# EAGLE design IC555 (EAGLE 9.6.2)
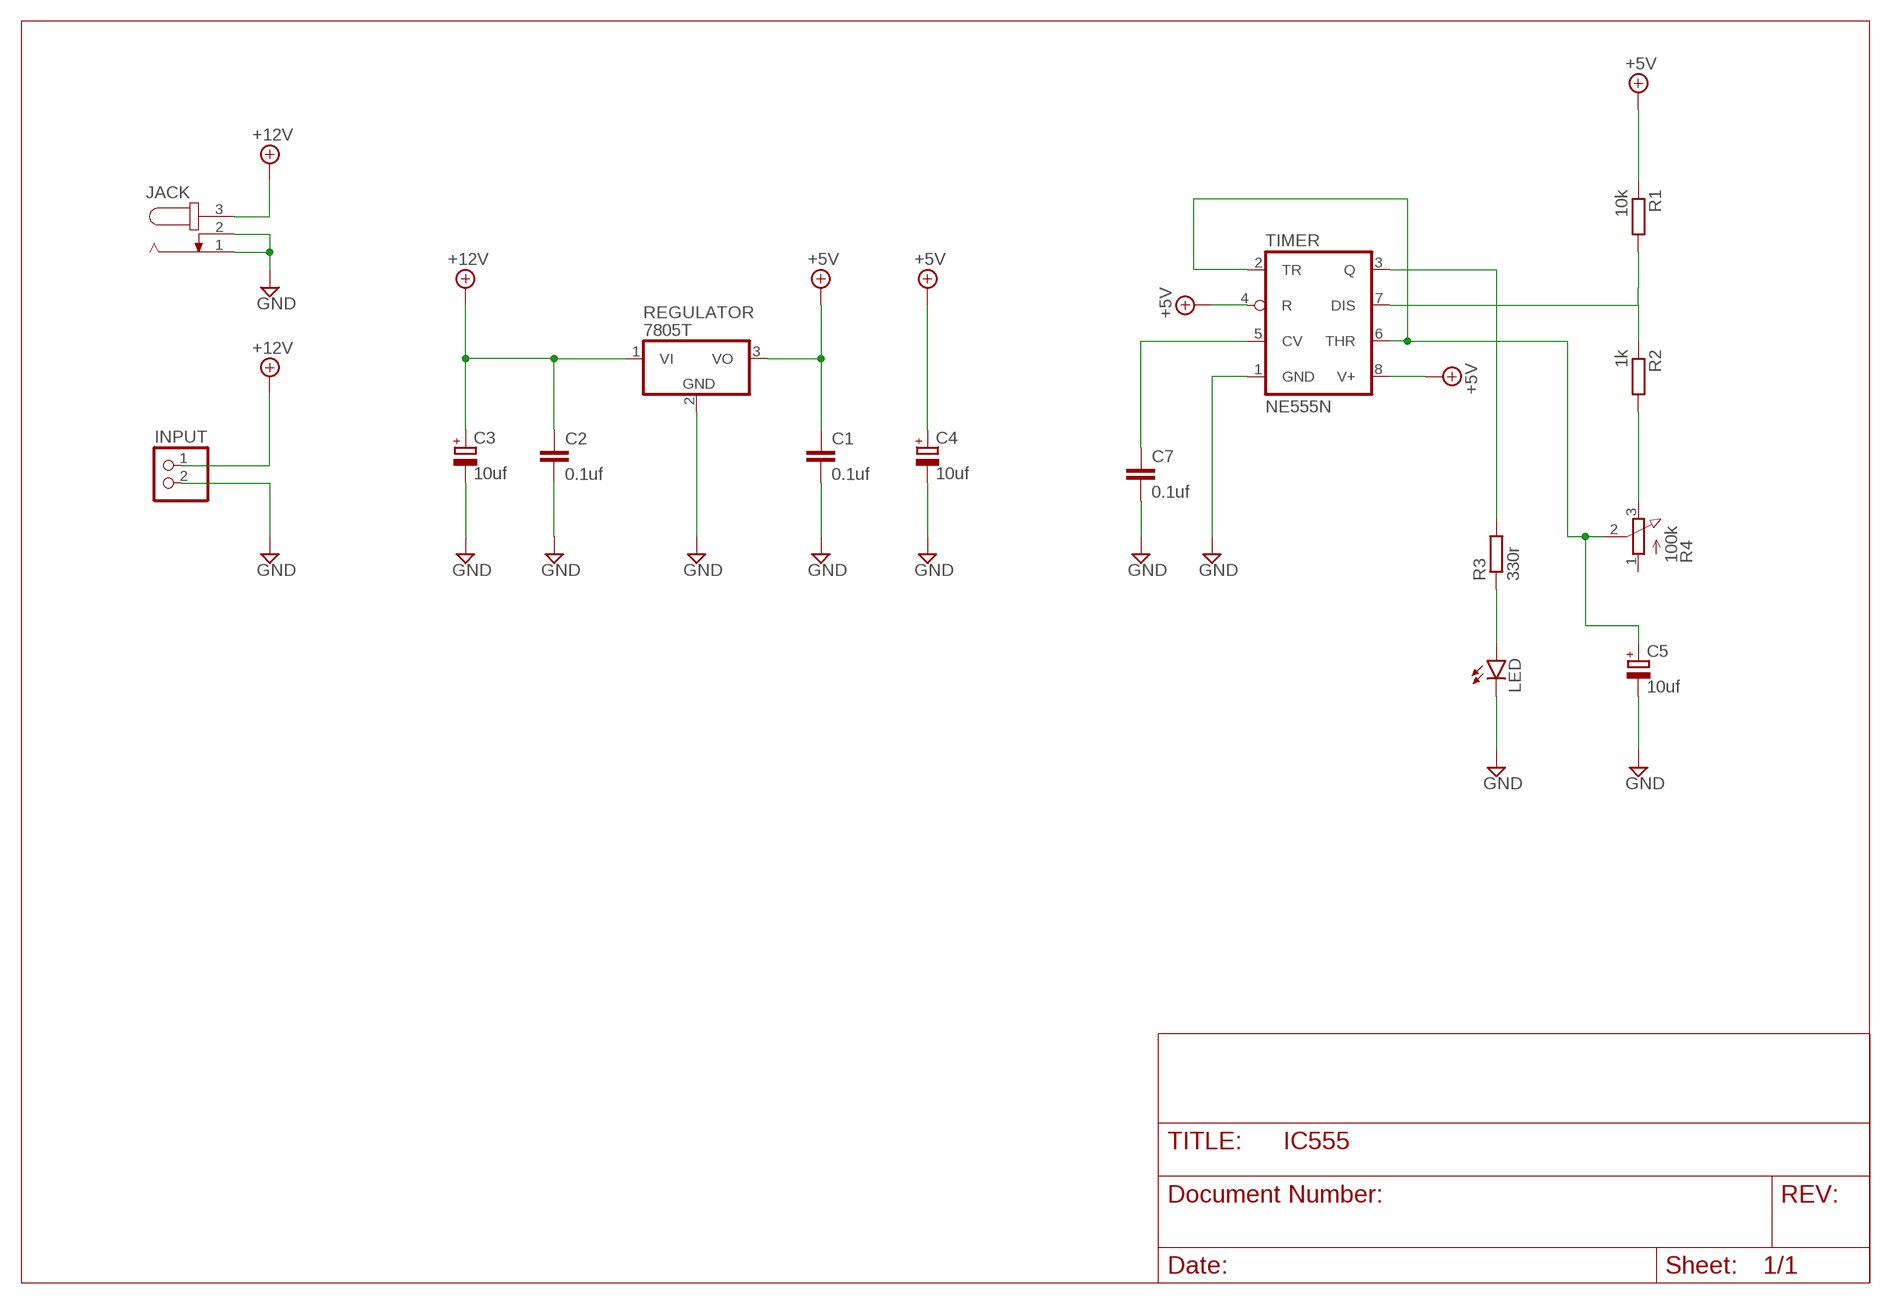
[diagram p0: schematic, sheet 1]

## Parts
C1  0.1uf  C-EU050-030X075  [C050-030X075]
C2  0.1uf  C-EU050-030X075  [C050-030X075]
C3  10uf  CPOL-EUE3.5-8  [E3,5-8]
C4  10uf  CPOL-EUE3.5-8  [E3,5-8]
C5  10uf  CPOL-EUE3.5-8  [E3,5-8]
C7  0.1uf  C-EU050-030X075  [C050-030X075]
INPUT  PINHD-1X2  [1X02]
JACK  JACK-PLUG0  [SPC4077]
LED  LED5MM  [LED5MM]
R1  10k  R-EU_0207/10  [0207/10]
R2  1k  R-EU_0207/10  [0207/10]
R3  330r  R-EU_0207/10  [0207/10]
R4  100k  3RP/1610N  [3RP/1610N]
REGULATOR  7805T  [TO220H]
TIMER  NE555N  [DIL08]

## Nets
+5V [POWER]: C1.1 C4.+ R1.1 REGULATOR.3(VO) TIMER.4(R) TIMER.8(V+)
+12V [POWER]: C2.1 C3.+ INPUT.1 JACK.3 REGULATOR.1(VI)
GND [POWER]: C1.2 C2.2 C3.- C4.- C5.- C7.2 INPUT.2 JACK.1 JACK.2 LED.K(C) REGULATOR.2(GND) TIMER.1(GND)
N$2: C7.1 TIMER.5(CV)
N$4: R3.2 TIMER.3(Q)
N$5: LED.A R3.1
N$6: R1.2 R2.1 TIMER.7(DIS)
N$7: R2.2 R4.3(E)
N$8: C5.+ R4.2(S) TIMER.2(TR) TIMER.6(THR)
Unconnected: R4.1(A)

## Library data of the parts
C1 C2 C7 = rcl:C-EU: CAPACITOR, European symbol; SPICEPREFIX: C
C3-C5 = rcl:CPOL-EU: POLARIZED CAPACITOR, European symbol; SPICEPREFIX: C
INPUT = pinhead:PINHD-1X2: PIN HEADER
JACK = con-jack:JACK-PLUG: DC POWER JACK Power Jack, DC, Right Angle, Through Hole, Rated 5A at 16VDC, PC Terminals Distributor: Farnell (www.Farnell.de) Drawing: 84N1161.pdf / 84N1162.pdf Manufacturer: SPC Technology (www.spctechnology.com) Type: SPC4077 / SPC 4078; OC_FARNELL: unknown; OC_NEWARK: unknown
LED = led:LED: LED OSRAM: - CHIPLED LG R971, LG N971, LY N971, LG Q971, LY Q971, LO R971, LY R971 LH N974, LH R974 LS Q976, LO Q976, LY Q976 LO Q996 - Hyper CHIPLED LW Q18S LB Q993, LB Q99A, LB R99A - SideLED LS A670, LO A670, LY A670, LG A670, LP A670 LB A673, LV A673, LT A673, LW A673 LH A674 LY A675 LS A676, LA A676, LO A676, LY A676, LW A676 LS A679, LY A679, LG A679 - Hyper Micro SIDELED® LS Y876, LA Y876, LO Y876, LY Y876 LT Y87S - SmartLED LW L88C, LW L88S LB L89C, LB L89S, LG L890 LS L89K, LO L89K, LY L89K LS L896, LA L896, LO L896, LY L896 - TOPLED LS T670, LO T670, LY T670, LG T670, LP T670 LSG T670, LSP T670, LSY T670, LOP T670, LYG T670 LG T671, LOG T671, LSG T671 LB T673, LV T673, LT T673, LW T673 LH T674 LS T676, LA T676, LO T676, LY T676, LB T676, LH T676, LSB T676, LW T676 LB T67C, LV T67C, LT T67C, LS T67K, LO T67K, LY T67K, LW E67C LS E67B, LA E67B, LO E67B, LY E67B, LB E67C, LV E67C, LT E67C LW T67C LS T679, LY T679, LG T679 LS T770, LO T770, LY T770, LG T770, LP T770 LB T773, LV T773, LT T773, LW T773 LH T774 LS E675, LA E675, LY E675, LS T675 LS T776, LA T776, LO T776, LY T776, LB T776 LHGB T686 LT T68C, LB T68C - Hyper Mini TOPLED® LB M676 - Mini TOPLED Santana® LG M470 LS M47K, LO M47K, LY M47K Source: http://www.osram.convergy.de LUXEON: - LUMILED® LXK2-PW12-R00, LXK2-PW12-S00, LXK2-PW14-U00, LXK2-PW14-V00 LXK2-PM12-R00, LXK2-PM12-S00, LXK2-PM14-U00 LXK2-PE12-Q00, LXK2-PE12-R00, LXK2-PE12-S00, LXK2-PE14-T00, LXK2-PE14-U00 LXK2-PB12-K00, LXK2-PB12-L00, LXK2-PB12-M00, LXK2-PB14-N00, LXK2-PB14-P00, LXK2-PB14-Q00 LXK2-PR12-L00, LXK2-PR12-M00, LXK2-PR14-Q00, LXK2-PR14-R00 LXK2-PD12-Q00, LXK2-PD12-R00, LXK2-PD12-S00 LXK2-PH12-R00, LXK2-PH12-S00 LXK2-PL12-P00, LXK2-PL12-Q00, LXK2-PL12-R00 Source: www.luxeon.com KINGBRIGHT: KA-3528ASYC Source: www.kingbright.com
R1-R3 = rcl:R-EU_: RESISTOR, European symbol; SPICEPREFIX: R
R4 = pot:3RP/1610N: 16mm Potentiometer one level Source: http://www.alphapotentiometers.net/html/16mm_pot_2.html
REGULATOR = linear:78*: Positive VOLTAGE REGULATOR Source: http://cache.national.com/ds/LM/LM78L05.pdf http://www.fairchildsemi.com/ds/LM/LM7805.pdf
TIMER = linear:*555: TIMER

## Net classes
0 default: width 0.305 mm, drill 0.305 mm, clearance 0.254 mm
1 POWER: width 0.406 mm, drill 0.406 mm, clearance 0.406 mm

## Board
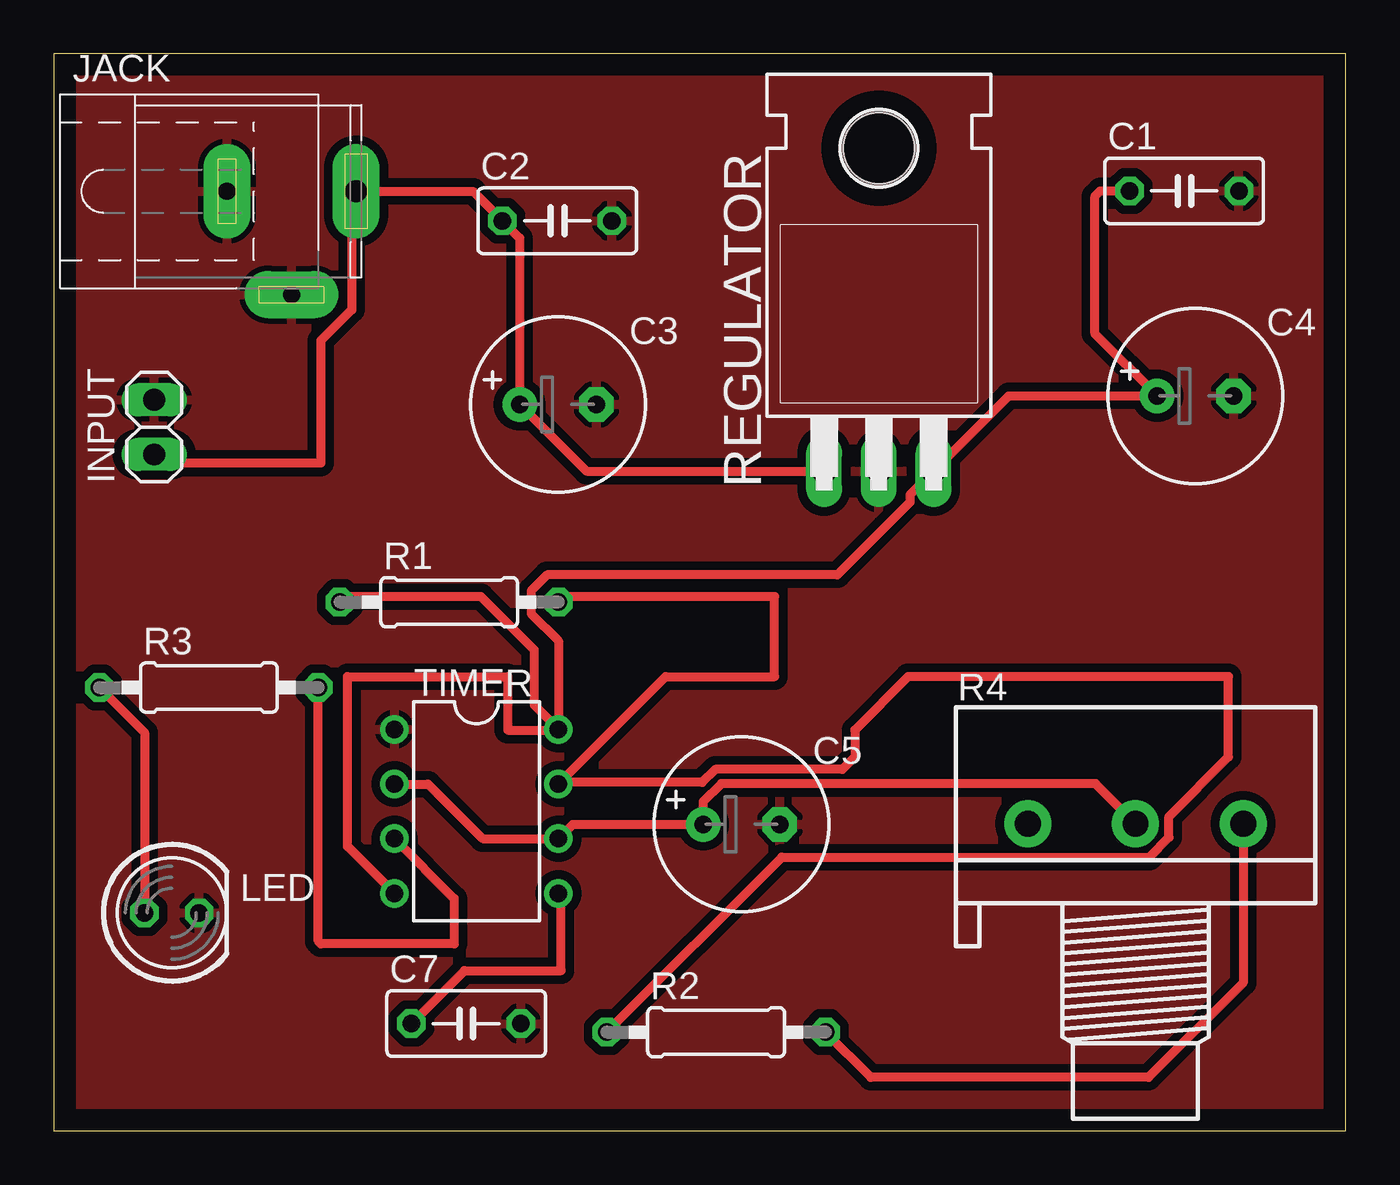
[diagram p1: board, top side]

Size 60 x 50 mm. Coordinates in mm from the lower left corner, seen from the top.
Outline: 0,0 60,0 60,50 0,50 0,0
Copper layers (1*16): Top 0.035mm / dielectric 1.5mm / Bottom 0.035mm
Design rules "default": minimum track width 6mil, minimum drill 0.35mm, track to track 6mil, track to pad 6mil, pad to pad 6mil, via to via 6mil, smd to smd 6mil, copper to edge 40mil, drill to drill 6mil, minimum pad ring 10mil, minimum via ring 8mil, stop-mask expansion 4mil, vias tented up to drill 0mil, thermal gap 10mil

### Footprints (pad centres in the part's own frame; a part is rotated, then mirrored left to right if it is on the bottom)
C050-030X075 = drill 0.813 octagon: 1 -2.54,0; 2 2.54,0
E3,5-8 = drill 0.813 pad 1.6: + -1.778,0 | drill 0.813 pad 1.6 octagon: - 1.778,0
1X02 = drill 1.016 long: 1 -1.27,0; 2 1.27,0
SPC4077 = drill 0.8 pad 2.184 long: 1 -3,0; 2 0,-4.8 | drill 1 pad 2.184 long: 3 3,0
LED5MM = drill 0.813 octagon: A -1.27,0; K 1.27,0
0207/10 = drill 0.813 octagon: 1 -5.08,0; 2 5.08,0
3RP/1610N = drill 1.2 pad 2.184: 1 -5,0; 2 0,0; 3 5,0
TO220H = drill 1.118 long: 1 -2.54,-10.16; 2 0,-10.16; 3 2.54,-10.16 | hole 3.302: 0,4.826
DIL08 = drill 0.813 pad 1.27: 1 -3.81,-3.81; 2 -1.27,-3.81; 3 1.27,-3.81; 4 3.81,-3.81; 5 3.81,3.81; 6 1.27,3.81; 7 -1.27,3.81; 8 -3.81,3.81

### Placement (x,y rotation side)
C1  52.5,43.64 0 top
C2  23.38,42.25 0 top
C3  23.42,33.72 0 top
C4  53.02,34.12 0 top
C5  31.94,14.23 0 top
C7  19.15,4.98 0 top
INPUT  4.66,32.67 90 top
JACK  11.04,43.62 0 top
LED  5.48,10.12 0 top
R1  18.36,24.54 0 top
R2  30.76,4.58 0 top
R3  7.2,20.58 0 top
R4  50.24,14.26 0 top
REGULATOR  38.32,40.79 0 top
TIMER  19.63,14.83 270 top

### Tracks (layer width: path | path; a pad name or v marks a point on that pad's centre or on a via)
+5V
  Top 0.406: C1.1 48.6,43.64 48.36,43.4 48.36,37 C4.+ 44.35,34.12 REGULATOR.3 39.77,29.54 39.77,29.19 36.39,25.81 22.91,25.81 22.17,25.07 22.17,24.01 23.44,22.74 TIMER.8 | TIMER.8 22.32,19.76 22.32,22.32 19.84,24.8 13.54,24.8 R1.1 | TIMER.8 23.4,18.6 21.08,18.6 21.08,21.08 13.64,21.08 13.64,13.2 TIMER.4
+12V
  Top 0.406: REGULATOR.1 24.73,30.63 C3.+ 21.64,41.45 C2.1 19.47,43.62 JACK.3 13.83,43.41 13.83,38.12 12.4,36.68 12.4,31 5.06,31 INPUT.1
GND
  pour Top (isolate 0.406): 0,49.6 59.52,49.6 59.52,0 0,0
N$2
  Top 0.406: C7.1 19.07,7.44 23.56,7.44 23.56,10.9 TIMER.5
N$4
  Top 0.406: TIMER.3 18.6,10.78 18.6,8.68 12.4,8.68 12.28,8.8 R3.2
N$5
  Top 0.406: R3.1 4.21,18.49 LED.A
N$6
  Top 0.406: TIMER.7 23.51,16.17 | 23.51,16.17 28.42,21.08 33.48,21.08 33.48,24.8 23.7,24.8 R1.2 | R2.1 33.81,12.71 50.88,12.71 51.79,13.62 51.79,14.59 54.56,17.36 54.56,21.08 39.68,21.08 37.2,18.6 37.2,17.36 36.62,16.78 30.73,16.78 30.12,16.17 23.51,16.17
N$7
  Top 0.406: R4.3 55.24,6.88 50.84,2.48 37.94,2.48 R2.2
N$8
  Top 0.406: R4.2 48.38,16.12 31,16.12 30.16,15.28 C5.+ 24.11,14.23 TIMER.6 19.92,13.56 17.38,16.1 TIMER.2